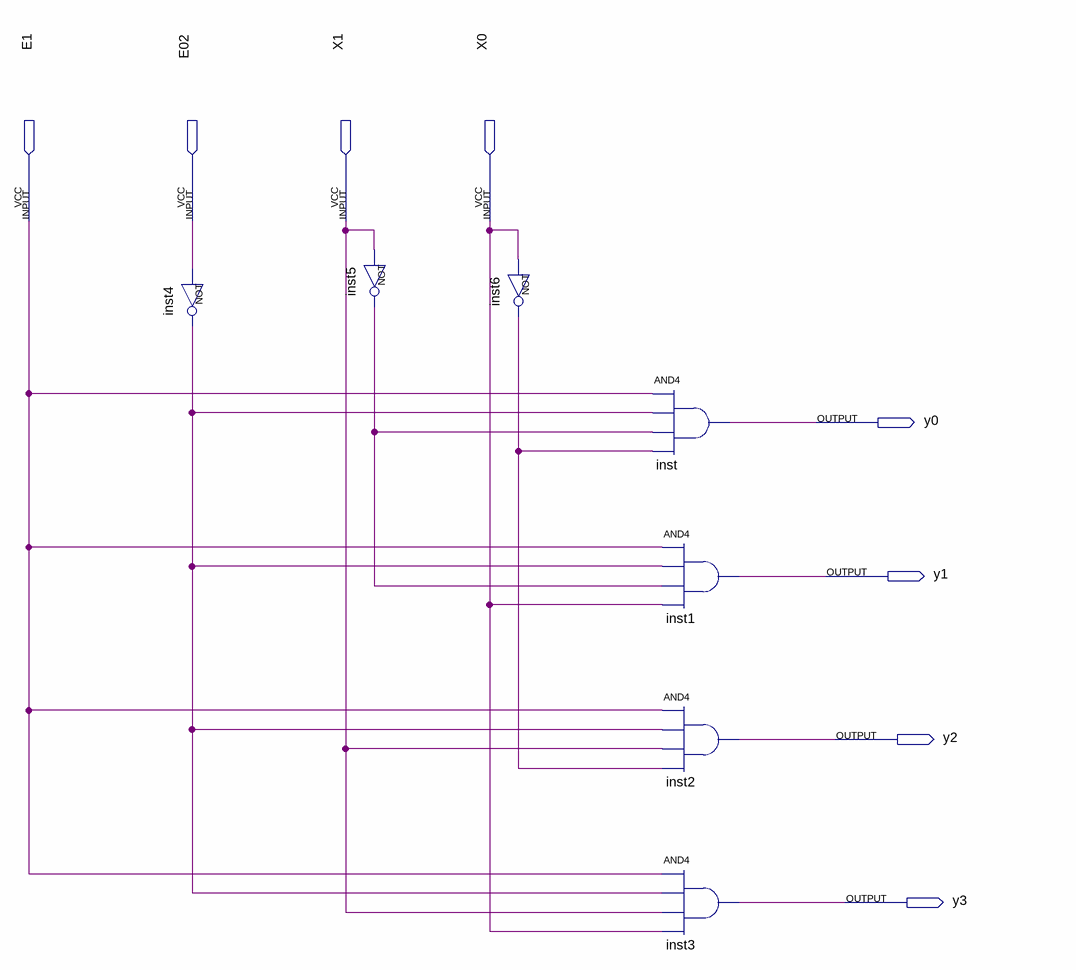
[diagram p0: schematic sheet]
// Quartus schematic aula0601.bdf as structural Verilog: 7 symbols, 8 pins
module aula0601 (
  input  E1,
  input  E02,
  input  X1,
  input  X0,
  output y0,
  output y1,
  output y2,
  output y3
);

  wire inst4_out, inst5_out, inst6_out;

  not inst4 (inst4_out, E02);
  not inst5 (inst5_out, X1);
  not inst6 (inst6_out, X0);
  and inst (y0, E1, inst4_out, inst5_out, inst6_out);
  and inst1 (y1, E1, inst4_out, inst5_out, X0);
  and inst2 (y2, E1, inst4_out, X1, inst6_out);
  and inst3 (y3, E1, inst4_out, X1, X0);
endmodule
